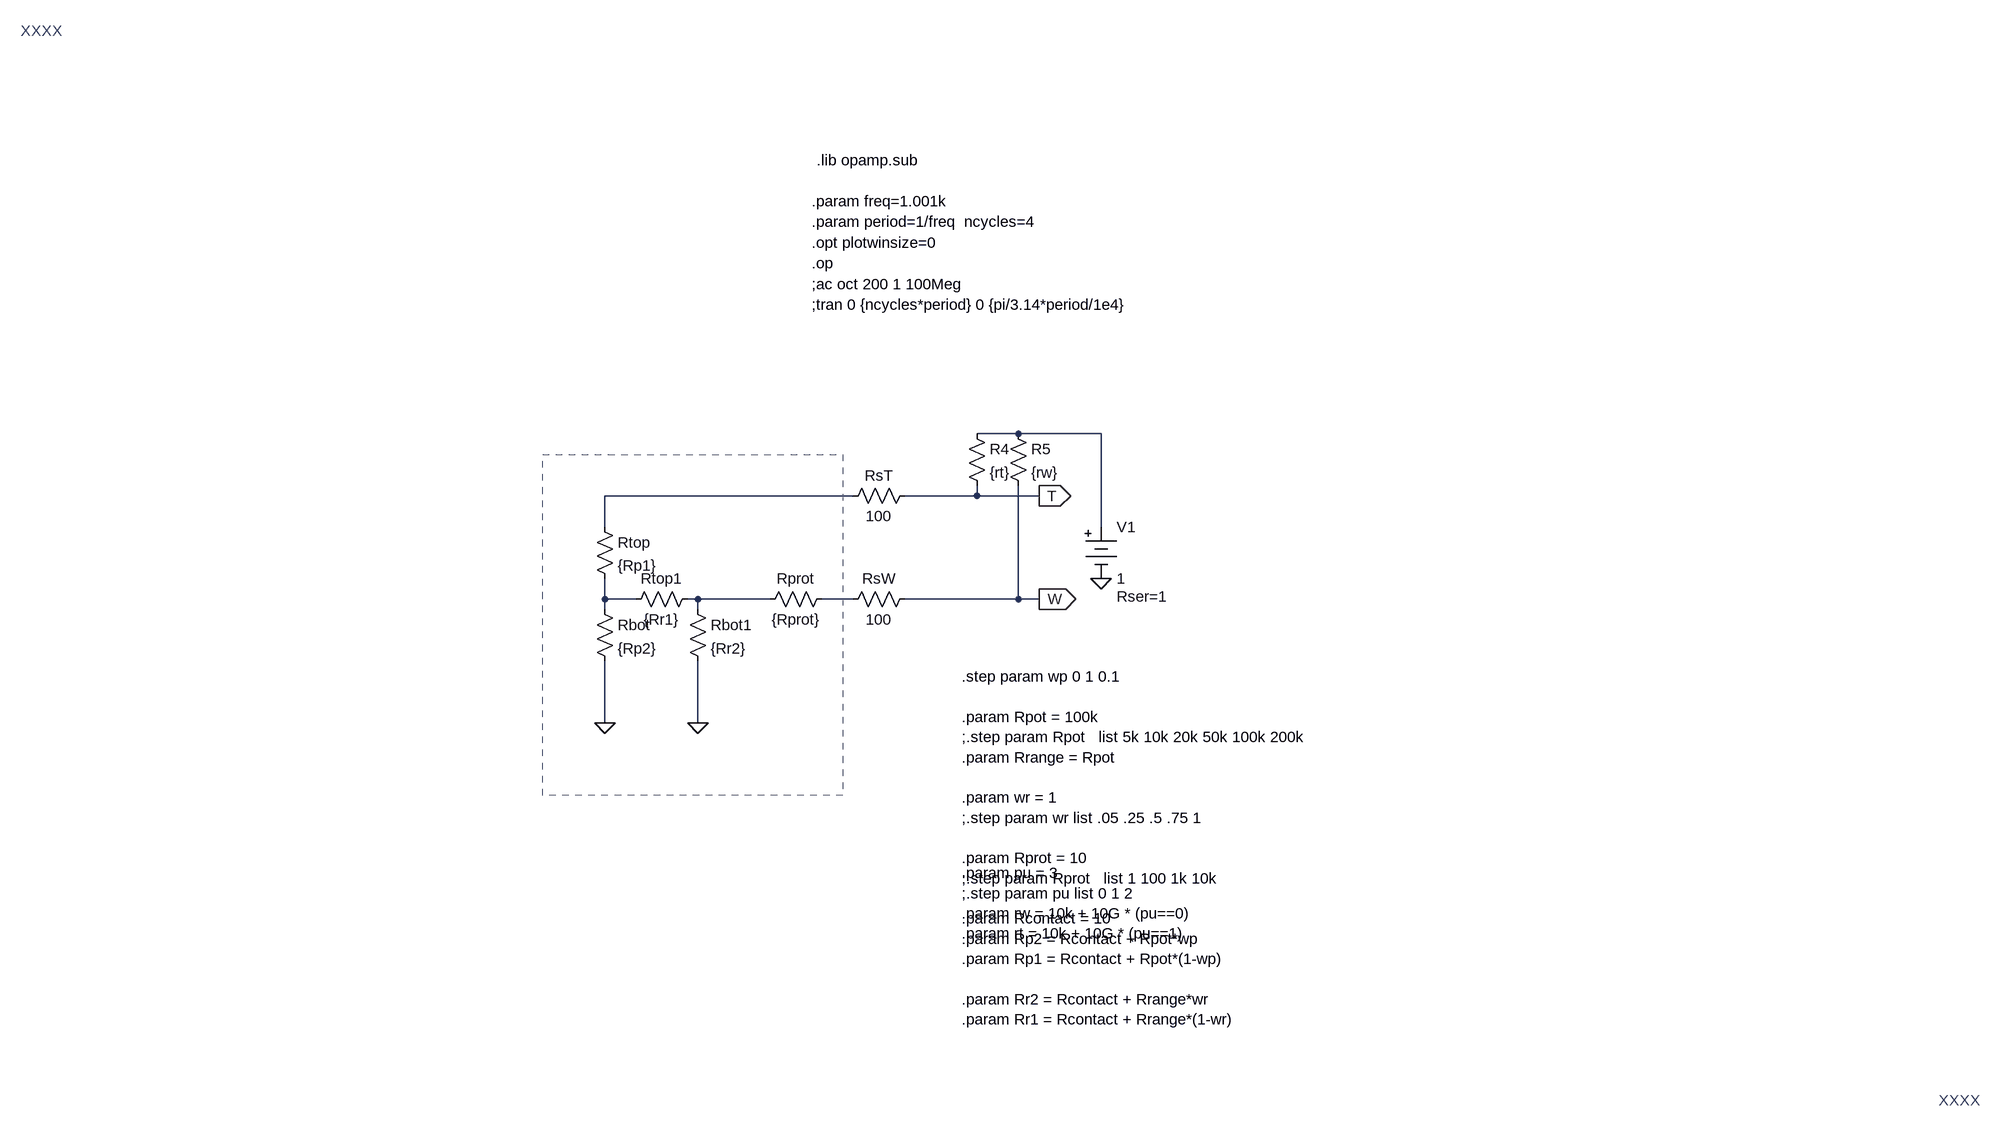
[diagram p0: schematic Ranged_Pot.asc]
Ranged_Pot.asc, the LTspice schematic file:
Version 4
SHEET 1 2700 1296
WIRE 1200 -208 1136 -208
WIRE 1328 -208 1200 -208
WIRE 944 -112 560 -112
WIRE 1056 -112 1024 -112
WIRE 1136 -112 1136 -128
WIRE 1136 -112 1056 -112
WIRE 1232 -112 1136 -112
WIRE 560 -64 560 -112
WIRE 1328 -64 1328 -208
WIRE 560 48 560 16
WIRE 608 48 560 48
WIRE 704 48 688 48
WIRE 816 48 704 48
WIRE 944 48 896 48
WIRE 1056 48 1024 48
WIRE 1200 48 1200 -128
WIRE 1200 48 1056 48
WIRE 1232 48 1200 48
WIRE 560 64 560 48
WIRE 704 64 704 48
WIRE 560 240 560 144
WIRE 704 240 704 144
FLAG 560 240 0
FLAG 1328 16 0
FLAG 1232 48 W
IOPIN 1232 48 Out
FLAG 1232 -112 T
IOPIN 1232 -112 Out
FLAG 704 240 0
DATAFLAG 1056 -112 ""
DATAFLAG 1056 48 ""
SYMBOL Misc\\battery 1328 -80 R0
WINDOW 123 0 0 Left 2
WINDOW 39 24 124 Left 2
SYMATTR SpiceLine Rser=1
SYMATTR InstName V1
SYMATTR Value 1
SYMBOL res 704 32 R90
WINDOW 0 0 56 VBottom 2
WINDOW 3 32 56 VTop 2
SYMATTR InstName Rtop1
SYMATTR Value {Rr1}
SYMBOL res 1040 32 R90
WINDOW 0 0 56 VBottom 2
WINDOW 3 32 56 VTop 2
SYMATTR InstName RsW
SYMATTR Value 100
SYMBOL res 1040 -128 R90
WINDOW 0 0 56 VBottom 2
WINDOW 3 32 56 VTop 2
SYMATTR InstName RsT
SYMATTR Value 100
SYMBOL res 1120 -224 R0
SYMATTR InstName R4
SYMATTR Value {rt}
SYMBOL res 1184 -224 R0
SYMATTR InstName R5
SYMATTR Value {rw}
SYMBOL res 544 -80 R0
SYMATTR InstName Rtop
SYMATTR Value {Rp1}
SYMBOL res 544 48 R0
SYMATTR InstName Rbot
SYMATTR Value {Rp2}
SYMBOL res 912 32 R90
WINDOW 0 0 56 VBottom 2
WINDOW 3 32 56 VTop 2
SYMATTR InstName Rprot
SYMATTR Value {Rprot}
SYMBOL res 688 48 R0
SYMATTR InstName Rbot1
SYMATTR Value {Rr2}
TEXT 880 -504 Left 2 !.opt plotwinsize=0
TEXT 880 -568 Left 2 !.param freq=1.001k\n.param period=1/freq  ncycles=4
TEXT 880 -472 Left 2 !.op
TEXT 880 -440 Left 2 !;ac oct 200 1 100Meg
TEXT 880 -408 Left 2 !;tran 0 {ncycles*period} 0 {pi/3.14*period/1e4}
TEXT 888 -632 Left 2 !.lib opamp.sub
TEXT 2624 824 Left 2 ;XXXX
TEXT -344 -832 Left 2 ;XXXX
TEXT 1112 168 Left 2 !.step param wp 0 1 0.1\n \n.param Rpot = 100k\n;.step param Rpot   list 5k 10k 20k 50k 100k 200k\n.param Rrange = Rpot\n \n.param wr = 1\n;.step param wr list .05 .25 .5 .75 1\n \n.param Rprot = 10\n;.step param Rprot   list 1 100 1k 10k\n \n.param Rcontact = 10\n.param Rp2 = Rcontact + Rpot*wp\n.param Rp1 = Rcontact + Rpot*(1-wp)\n \n.param Rr2 = Rcontact + Rrange*wr\n.param Rr1 = Rcontact + Rrange*(1-wr)
TEXT 1112 472 Left 2 !.param pu = 3\n;.step param pu list 0 1 2\n.param rw = 10k + 10G * (pu==0)\n.param rt = 10k + 10G * (pu==1)
RECTANGLE Normal 928 352 464 -176 2

The netlist it stands for:
* Ranged_Pot.asc
V1 N001 0 1 Rser=1
Rtop1 N004 N003 {Rr1}
RsW W N005 100
RsT T N002 100
R4 N001 T {rt}
R5 N001 W {rw}
Rtop N002 N003 {Rp1}
Rbot N003 0 {Rp2}
Rprot N005 N004 {Rprot}
Rbot1 N004 0 {Rr2}
.opt plotwinsize=0
.param freq=1.001k
.param period=1/freq  ncycles=4
.op
;ac oct 200 1 100Meg
;tran 0 {ncycles*period} 0 {pi/3.14*period/1e4}
.lib opamp.sub
* XXXX
* XXXX
.step param wp 0 1 0.1
.param Rpot = 100k
;.step param Rpot   list 5k 10k 20k 50k 100k 200k
.param Rrange = Rpot
.param wr = 1
;.step param wr list .05 .25 .5 .75 1
.param Rprot = 10
;.step param Rprot   list 1 100 1k 10k
.param Rcontact = 10
.param Rp2 = Rcontact + Rpot*wp
.param Rp1 = Rcontact + Rpot*(1-wp)
.param Rr2 = Rcontact + Rrange*wr
.param Rr1 = Rcontact + Rrange*(1-wr)
.param pu = 3
;.step param pu list 0 1 2
.param rw = 10k + 10G * (pu==0)
.param rt = 10k + 10G * (pu==1)
.backanno
.end